# Altium schematic sheet ORingSW.SchDoc
size A; SheetNumber: 4; SheetTotal: 10
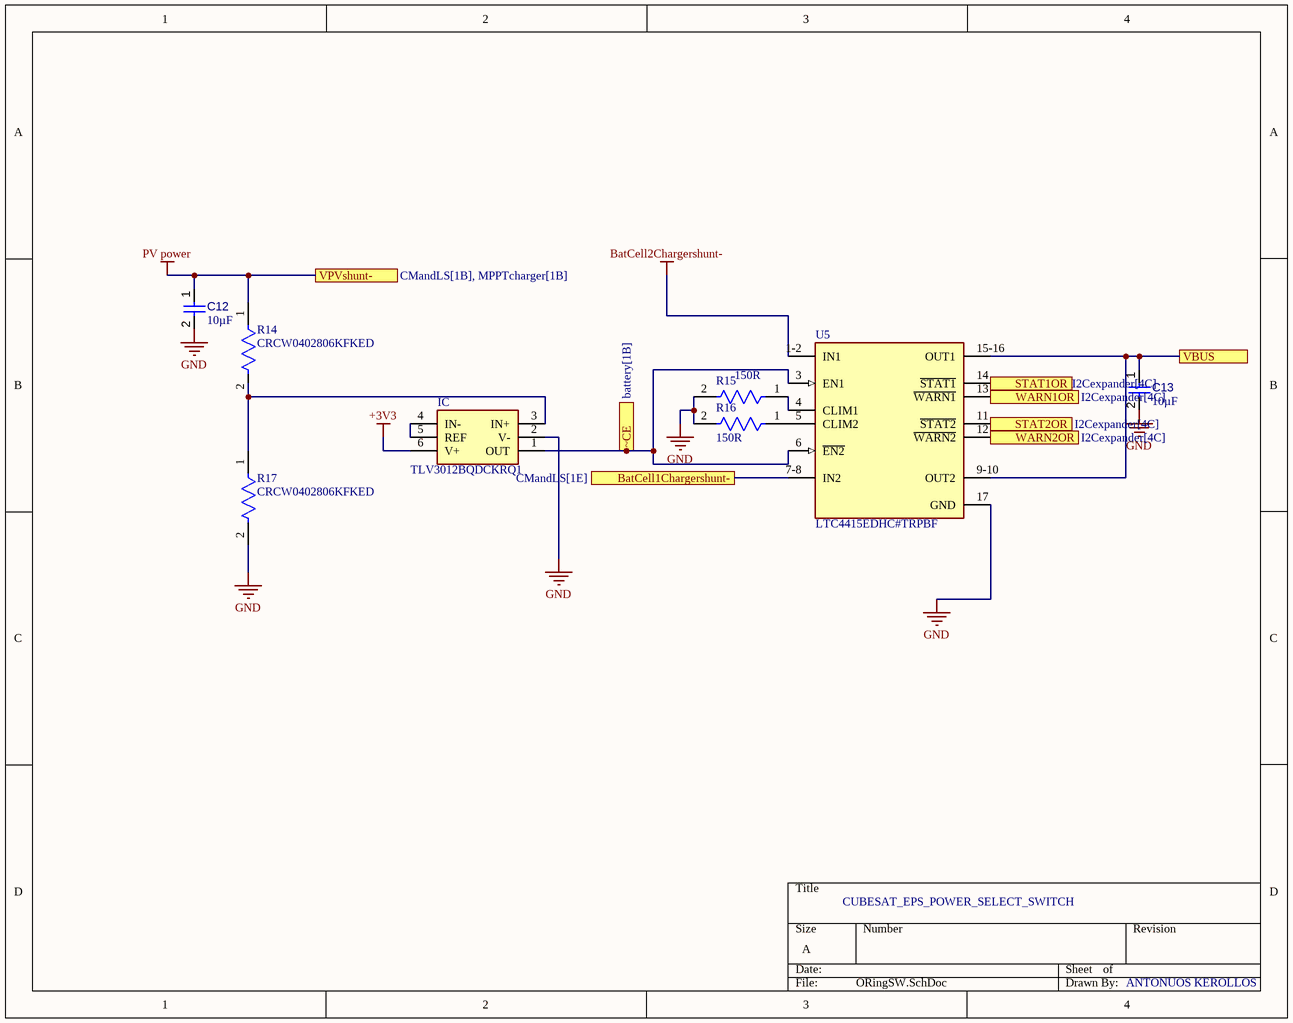
[diagram p0: ORingSW.SchDoc]

## Parts
C12  value 10µF  [CAPC0402(1005)60_L]  (hidden comment: Capacitor 10µF +/-40% 6.3V 0402)
C13  value 10µF  [CAPC0402(1005)60_L]  (hidden comment: Capacitor 10µF +/-40% 6.3V 0402)
IC  TLV3012BQDCKRQ1  [SOT65P210X110-6N]
R14  CRCW0402806KFKED  [FP-CRCW0402-e3-IPC_A]
R15  150R  [FP-CRCW0402-e3-IPC_A]
R16  150R  [FP-CRCW0402-e3-IPC_A]
R17  CRCW0402806KFKED  [FP-CRCW0402-e3-IPC_A]
U5  LTC4415EDHC#TRPBF  [FP-DHC-16-05-08-1872-A-MFG]

## Ports
BatCell1Chargershunt- (see CMandLS[1E]), STAT1OR (see I2Cexpander[4C]), STAT2OR (see I2Cexpander[4C]), VBUS, VPVshunt- (see CMandLS[1B], MPPTcharger[1B]), WARN1OR (see I2Cexpander[4C]), WARN2OR (see I2Cexpander[4C]), ~CE (see battery[1B])

## Nets
+3V3: IC.6(V+)
BatCell2Chargershunt-: U5.1-2(IN1)
GND: C12.2 C13.2 IC.2(V-) R15.2 R16.2 R17.2 U5.17(GND)
PV power: C12.1 R14.1 ; port VPVshunt-
BatCell1Chargershunt-: U5.7-8(IN2) ; port BatCell1Chargershunt-
STAT1OR: U5.14(~{STAT1}) ; port STAT1OR
STAT2OR: U5.11(~{STAT2}) ; port STAT2OR
VBUS: C13.1 U5.9-10(OUT2) U5.15-16(OUT1) ; port VBUS
WARN1OR: U5.13(~{WARN1}) ; port WARN1OR
WARN2OR: U5.12(~{WARN2}) ; port WARN2OR
~CE: IC.1(OUT) U5.3(EN1) U5.6(~{EN2}) ; port ~CE
NetIC_3: IC.3(IN+) R14.2 R17.1
NetIC_4: IC.4(IN-) IC.5(REF)
NetR15_1: R15.1 U5.4(CLIM1)
NetR16_1: R16.1 U5.5(CLIM2)

## Notes on the sheet
- CUBESAT_EPS_POWER_SELECT_SWITCH
- ANTONUOS KEROLLOS

## Library data of the parts
C12 C13 = CMP-001-00074-3: Chip Capacitor, 10µF +/-40%, 6.3V, 0402, Thickness 0.6 mm; Tolerance: 10%; Case/Package: 0402; Pins: 2; Mounting Technology: SMT; Voltage Rating: 6.3V; Max Operating Temperature: 85°C; Min Operating Temperature: -55°C
IC = TLV3012BQDCKRQ1: Integrated Circuit; Manufacturer_Name: Texas Instruments; Datasheet Link: https://www.ti.com/lit/ds/symlink/tlv3012b-q1.pdf?ts=1694855984028&ref_url=https%253A%252F%252Fwww.ti.com%252Fproduct%252FTLV3012B-Q1%252Fpart-details%252FTLV3012BQDCKRQ1; Height: 1.1mm; Manufacturer_Part_Number: TLV3012BQDCKRQ1; Mouser Part Number: 595-TLV3012BQDCKRQ1; Mouser Price/Stock: https://www.mouser.co.uk/ProductDetail/Texas-Instruments/TLV3012BQDCKRQ1?qs=3Rah4i%252BhyCFJC4yY2NAdNA%3D%3D
R14 R17 = CMP-2002-00226-2: RES Thick Film, 806kΩ, 1%, 0.063W, 100ppm/°C, 0402; Power Rating: 63mW; Voltage Rating (DC): 50V; Resistance: 806kR; Case Code (Imperial): 0402; Radiation Hardening: No; Contact Plating: Tin; Weight: 2.3E-05oz; Height: 0.35mm; Depth: 0.5mm; Temperature Coefficient: 100ppm/°C; Composition: Thick Film; Lead Free: Lead Free; Number of Terminations: 2; Case Code (Metric): 1005; Features: Automotive AEC-Q200; Mount: Surface Mount; Voltage Rating: 50V; Max Operating Temperature: 155°C; Length: 1mm; Packaging: Tape and Reel; Min Operating Temperature: -55°C; Case/Package: 0402; Max Power Dissipation: 63mW; Military Standard: Not; Package Quantity: 10; Tolerance: 1%; Termination: SMD/SMT; Width: 0.5mm
R15 R16 = CMP-2002-08214-2: RES Thick Film, 150Ω, 1%, 0.063W, 100ppm/°C, 0402; Power Rating: 63mW; Voltage Rating: 50V; Packaging: Tape and Reel; Height: 0.35mm; Radiation Hardening: No; Min Operating Temperature: -55°C; Mount: Surface Mount; Contact Plating: Tin; Case/Package: 0402; Width: 0.5mm; Case Code (Imperial): 0402; Length: 1mm; Tolerance: 1%; Lead Free: Lead Free; Case Code (Metric): 1005; Military Standard: Not; Max Operating Temperature: 155°C; Temperature Coefficient: 100ppm/°C; Resistance: 150R; Weight: 2.3E-05oz; Voltage Rating (DC): 50V; Depth: 0.5mm; Package Quantity: 10000; Composition: Thick Film; Termination: SMD/SMT
U5 = CMP-0479-00073-2: IC OR CTRLR SRC SELECT 16DFN; Operating Supply Current: 44uA; Max Output Current: 4A; Package Quantity: 2500; Series: PowerPath™; Length: 5mm; Case/Package: DFN; Number of Pins: 16; Max Operating Temperature: 125°C; Packaging: Tape and Reel; RoHS Compliant: Yes; Min Operating Temperature: -40°C